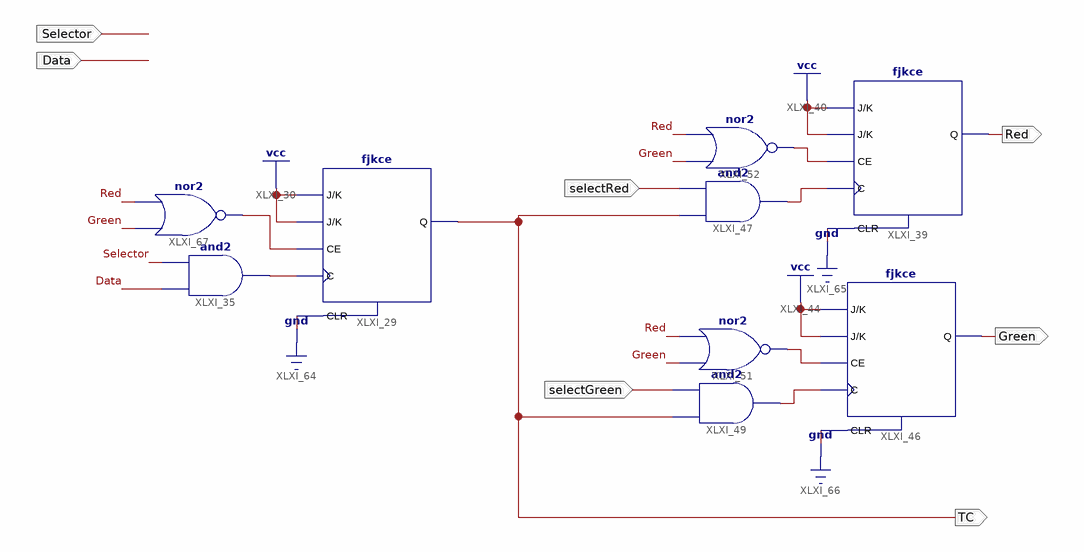
[diagram p0: schematic sheet 1]
// Xilinx ISE schematic ChooseRorG.sch (spartan6) as structural Verilog: 9 symbols, 8 ports
module ChooseRorG (
  input  Data,
  input  Selector,
  input  selectRed,
  input  selectGreen,
  output XLXN_69,
  output Red,
  output Green,
  output TC
);

  wire XLXN_54, XLXN_67, XLXN_77, XLXN_84, XLXN_85, XLXN_118;

  fjkce XLXI_29 (.C(XLXN_54), .CE(XLXN_118), .CLR(1'b0), .J(1'b1), .K(1'b1), .Q(TC));
  and XLXI_35 (XLXN_54, Data, Selector);
  fjkce XLXI_39 (.C(XLXN_67), .CE(XLXN_84), .CLR(1'b0), .J(1'b1), .K(1'b1), .Q(Red));
  fjkce XLXI_46 (.C(XLXN_77), .CE(XLXN_85), .CLR(1'b0), .J(1'b1), .K(1'b1), .Q(Green));
  and XLXI_47 (XLXN_67, TC, selectRed);
  and XLXI_49 (XLXN_77, TC, selectGreen);
  nor XLXI_51 (XLXN_85, Green, Red);
  nor XLXI_52 (XLXN_84, Green, Red);
  nor XLXI_67 (XLXN_118, Green, Red);
endmodule
